# Altium schematic sheet MCU.SchDoc
size A4; SheetNumber: 2; SheetTotal: 3
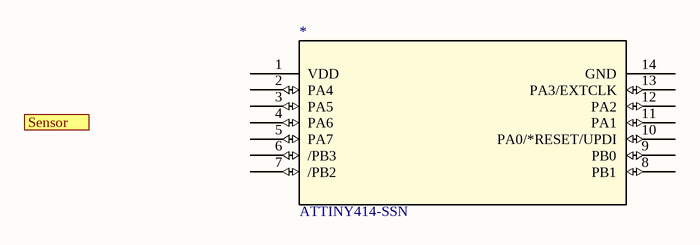
[diagram p0: MCU.SchDoc]

## Parts
*  ATTINY414-SSN

## Ports
Sensor

## Nets

Not connected (* = marked no-connect by the designer): * 1(VDD) 2(PA4) 3(PA5) 4(PA6) 5(PA7) 6(/PB3) 7(/PB2) 8(PB1) 9(PB0) 10(PA0/*RESET/UPDI) 11(PA1) 12(PA2) 13(PA3/EXTCLK) 14(GND)